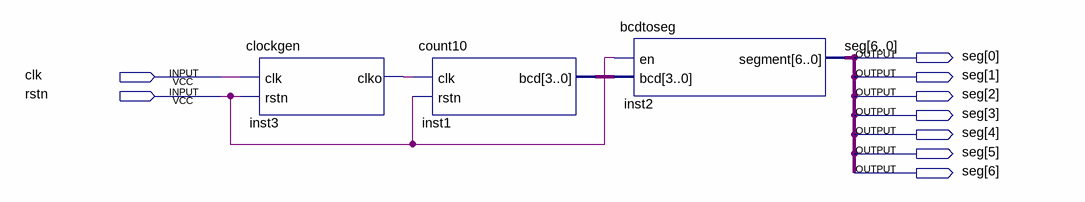
[diagram p0: schematic sheet]
// Quartus schematic dig2lab1.bdf as structural Verilog: 3 symbols, 9 pins
module dig2lab1 (
  input  clk,
  input  rstn,
  output [6:0] seg
);

  wire inst3_clko;
  wire [3:0] inst1_bcd;

  clockgen inst3 (.clk(clk), .rstn(rstn), .clko(inst3_clko));
  count10 inst1 (.clk(inst3_clko), .rstn(rstn), .bcd(inst1_bcd));
  bcdtoseg inst2 (.en(rstn), .bcd(inst1_bcd), .segment(seg));
endmodule
